# EAGLE design esc_ne5551 (EAGLE 7.5.0)
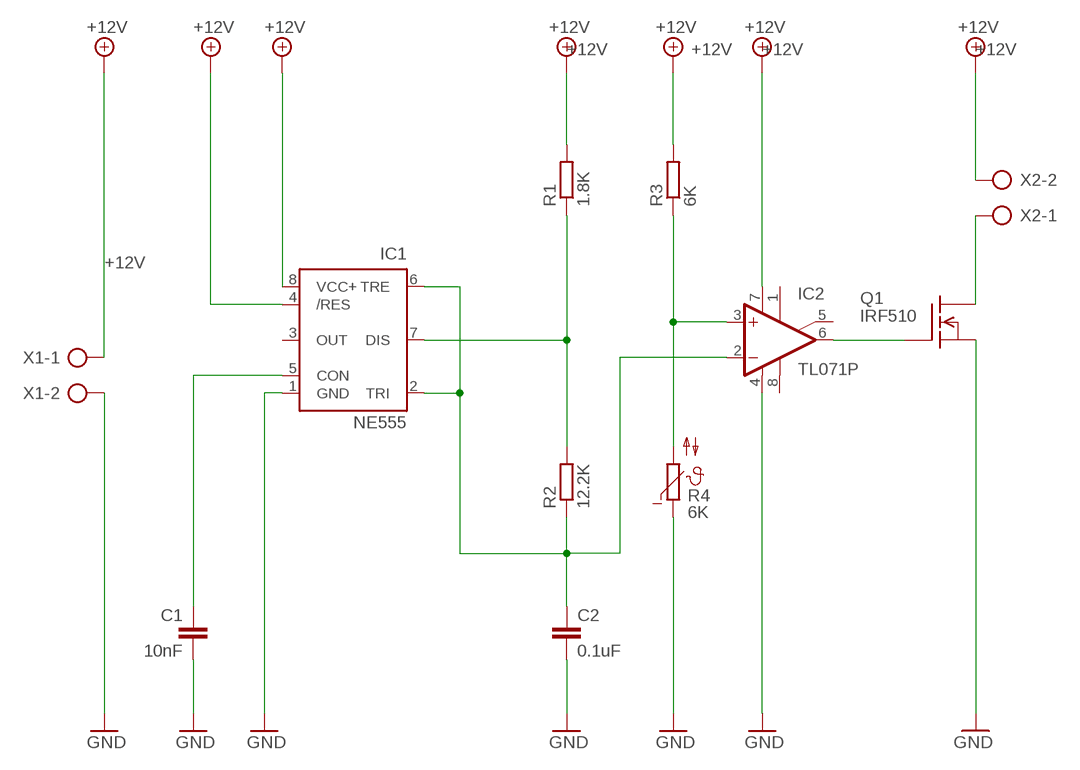
[diagram p0: schematic, sheet 1]

## Parts
C1  10nF  C-EU025-025X050  [C025-025X050]
C2  0.1uF  C-EU025-025X050  [C025-025X050]
IC1  NE555  [DIL-08]
IC2  TL071P  [DIL08]
Q1  IRF510  [TO220]
R1  1.8K  R-EU_0207/10  [0207/10]
R2  12.2K  R-EU_0207/10  [0207/10]
R3  6K  R-EU_0207/10  [0207/10]
R4  6K  NTC640  [P640]
X1  AK500/2  [AK500/2]
X2  AK500/2  [AK500/2]

## Nets
+12V: IC1.4(/RES) IC1.8(VCC+) IC2.7(V+) R1.2 R3.2 X1.1 X2.2
GND: C1.2 C2.2 IC1.1(GND) IC2.4(V-) Q1.3(S) R4.1 X1.2
N$1: IC1.7(DIS) R1.1 R2.2
N$2: IC2.3(+IN) R3.1 R4.2
N$5: Q1.2(D) X2.1
N$12: IC2.6(OUT) Q1.1(G)
N$18: C1.1 IC1.5(CON)
N$22: C2.1 IC1.2(TRI) IC1.6(TRE) IC2.2(-IN) R2.1
Unconnected: IC1.3(OUT) IC2.1(ON1) IC2.5(ON2) IC2.8(OPT)

## Library data of the parts
C1 C2 = resistor:C-EU: CAPACITOR, European symbol
IC1 = st-microelectronics:NE555: General purpose bipolar Timer; MF: Arrow Electronics; MPN: NE555N; OC_FARNELL: 1467742; OC_NEWARK: 89K1486
IC2 = linear:TL071: OP AMP
Q1 = transistor-fet:IRF510: N-Channel Enhancement MOSFET (HEXFET); 100V; 5,6A; 0,54Ohm
R1-R3 = resistor:R-EU_: RESISTOR, European symbol
R4 = ptc-ntc:NTC640: PHILIPS NTC; OC_FARNELL: unknown; OC_NEWARK: unknown
X1 X2 = con-ptr500:AK500/2: CONNECTOR; OC_FARNELL: unknown; OC_NEWARK: unknown

## Board
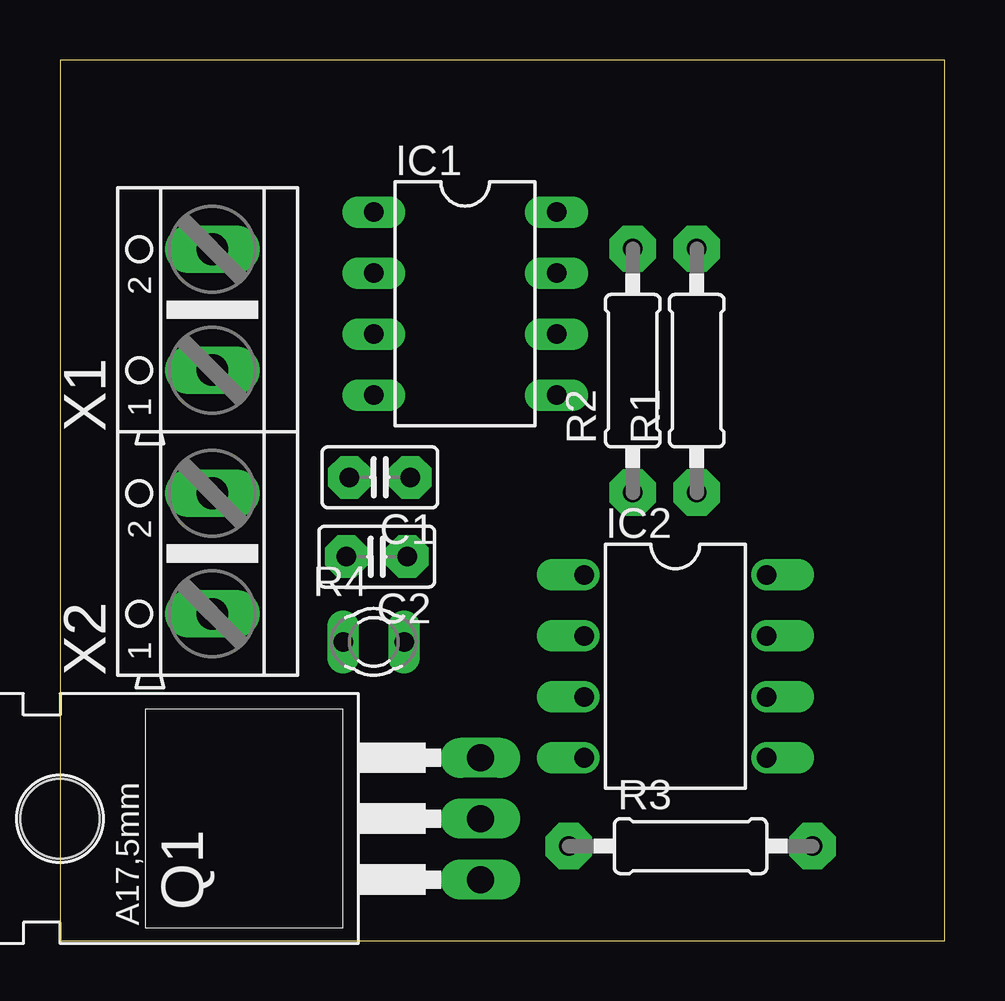
[diagram p1: board, top side]
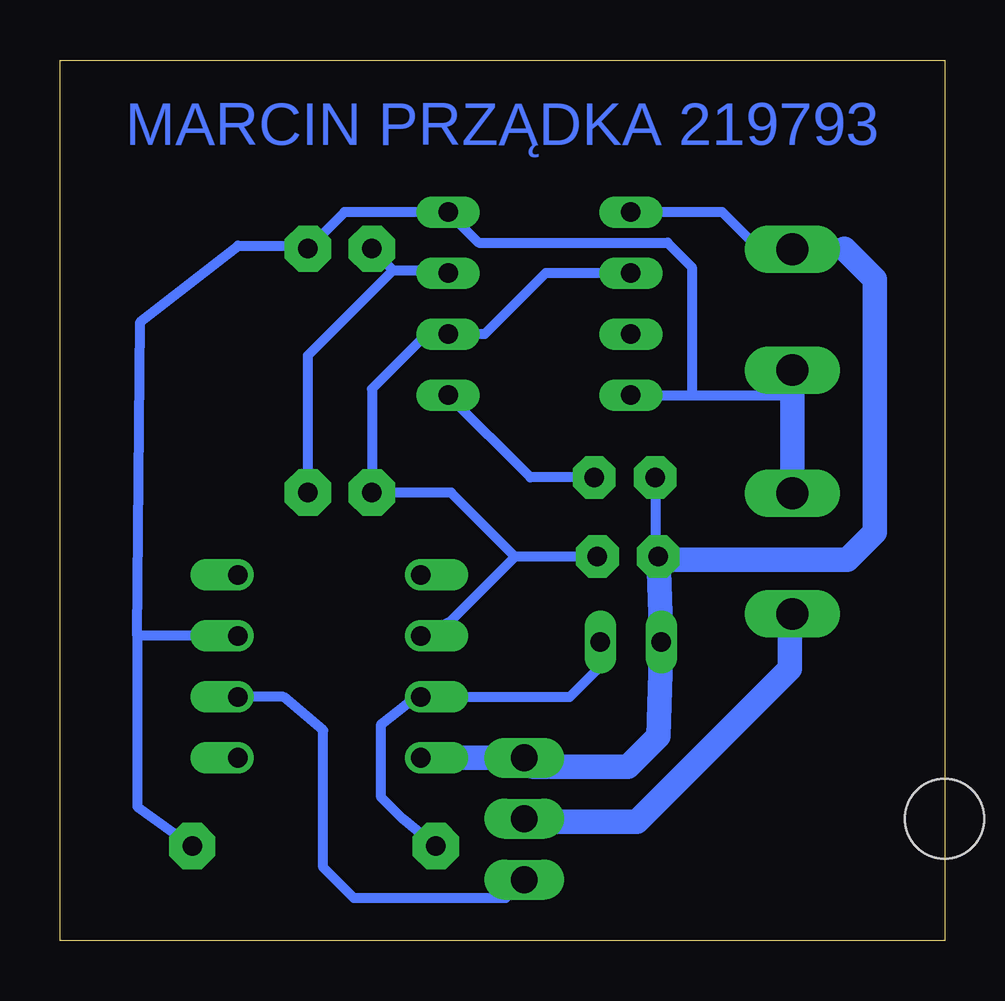
[diagram p2: board, bottom side, seen from below]

Size 36.88 x 36.69 mm. Coordinates in mm from the lower left corner, seen from the top.
Outline: 0,36.69 0,0 36.88,0 36.88,36.69 0,36.69
Copper layers (1*16): Top 0.035mm / dielectric 1.5mm / Bottom 0.035mm
Design rules "default": minimum track width 10mil, minimum drill 24mil, track to track 8mil, track to pad 8mil, pad to pad 8mil, via to via 8mil, smd to smd 8mil, copper to edge 40mil, drill to drill 8mil, minimum pad ring 10mil, minimum via ring 8mil, stop-mask expansion 4mil, vias tented up to drill 0mil, thermal gap 10mil

### Footprints (pad centres in the part's own frame; a part is rotated, then mirrored left to right if it is on the bottom)
C025-025X050 = drill 0.813 pad 1.778 octagon: 1 -1.27,0; 2 1.27,0
DIL-08 = drill 0.813 long: 1 -3.81,-3.81; 2 -1.27,-3.81; 3 1.27,-3.81; 4 3.81,-3.81; 5 3.81,3.81; 6 1.27,3.81; 7 -1.27,3.81; 8 -3.81,3.81
DIL08 = drill 0.813 pad 1.27 offset: 1 -3.81,-3.81; 2 -1.27,-3.81; 3 1.27,-3.81; 4 3.81,-3.81; 5 3.81,3.81; 6 1.27,3.81; 7 -1.27,3.81; 8 -3.81,3.81
TO220 = drill 1.118 long: 1 -2.54,-6.35; 2 0,-6.35; 3 2.54,-6.35 | hole 3.302: 0,11.176
0207/10 = drill 0.813 pad 1.93 octagon: 1 -5.08,0; 2 5.08,0
P640 = drill 0.813 long: 1 -1.27,0; 2 1.27,0
AK500/2 = drill 1.321 long: 1 -2.515,0; 2 2.515,0

### Placement (x,y rotation side)
C1  13.33,19.3 180 top
C2  13.21,16 180 top
IC1  16.89,26.54 270 top
IC2  25.65,11.43 270 top
Q1  11.18,5.08 90 top
R1  26.54,23.75 90 top
R2  23.88,23.75 90 top
R3  26.29,3.94 0 top
R4  13.08,12.45 0 top
X1  6.35,26.29 90 top
X2  6.35,16.13 90 top

### Tracks (layer width: path | path; a pad name or v marks a point on that pad's centre or on a via)
+12V
  Bottom 0.406: IC1.4 10.54,22.73 | 10.54,22.73 6.35,22.73 | IC2.7 33.66,12.7 | 10.54,22.73 10.54,28.07 11.56,29.08 19.43,29.08 IC1.8 25.02,30.35 R1.2 26.67,28.96 29.46,28.96 33.53,25.78 33.66,12.7 | 33.66,12.7 33.66,5.59 R3.2
  Bottom 1.016: X2.2 6.35,22.73 X1.1
GND
  Bottom 0.406: C1.2 12.06,16.13 C2.2 11.81,15.88 | 17.15,7.24 Q1.3 | 7.72,28.8 9.27,30.35 IC1.1
  Bottom 0.813: 5.31,28.8 5.84,28.8 5.82,28.83 4.19,28.83 | X1.2 7.72,28.8
  Bottom 1.016: C2.2 R4.1 11.94,8.51 13.21,7.24 17.15,7.24 | X1.2 5.84,28.8 | 11.81,15.88 4.06,15.88 2.92,17.02 2.92,27.56 4.19,28.83 | Q1.3 IC2.4
N$1
  Bottom 0.406: R1.1 26.54,24.38 22.99,27.94 | 22.99,27.94 20.83,27.94 IC1.7 | R2.2 22.99,27.94
N$2
  Bottom 0.406: R3.1 22.61,5.08 23.49,5.97 23.49,9.02 21.72,10.41 IC2.3 15.62,10.16 14.35,11.43 R4.2
N$5
  Bottom 0.406: X2.1 6.45,13.61 | 17.4,4.95 Q1.2
  Bottom 1.016: 6.45,13.61 6.45,11.33 12.83,4.95 17.4,4.95
N$12
  Bottom 0.406: IC2.6 27.56,10.16 25.91,8.76 25.91,3.05 24.64,1.78 18.29,1.78 Q1.1
N$18
  Bottom 0.406: C1.1 17.27,19.3 IC1.5
N$22
  Bottom 0.406: IC1.2 16.64,27.81 19.18,25.27 IC1.6 21.59,25.27 23.88,22.99 R2.1 20.57,18.67 17.91,16 | C2.1 17.91,16 | IC2.2 20.57,13.34 17.91,16

### Text on the board
Bottom: MARCIN PRZĄDKA 219793